# EAGLE design Castle_2_3_1_103113 (EAGLE 9.3.0)
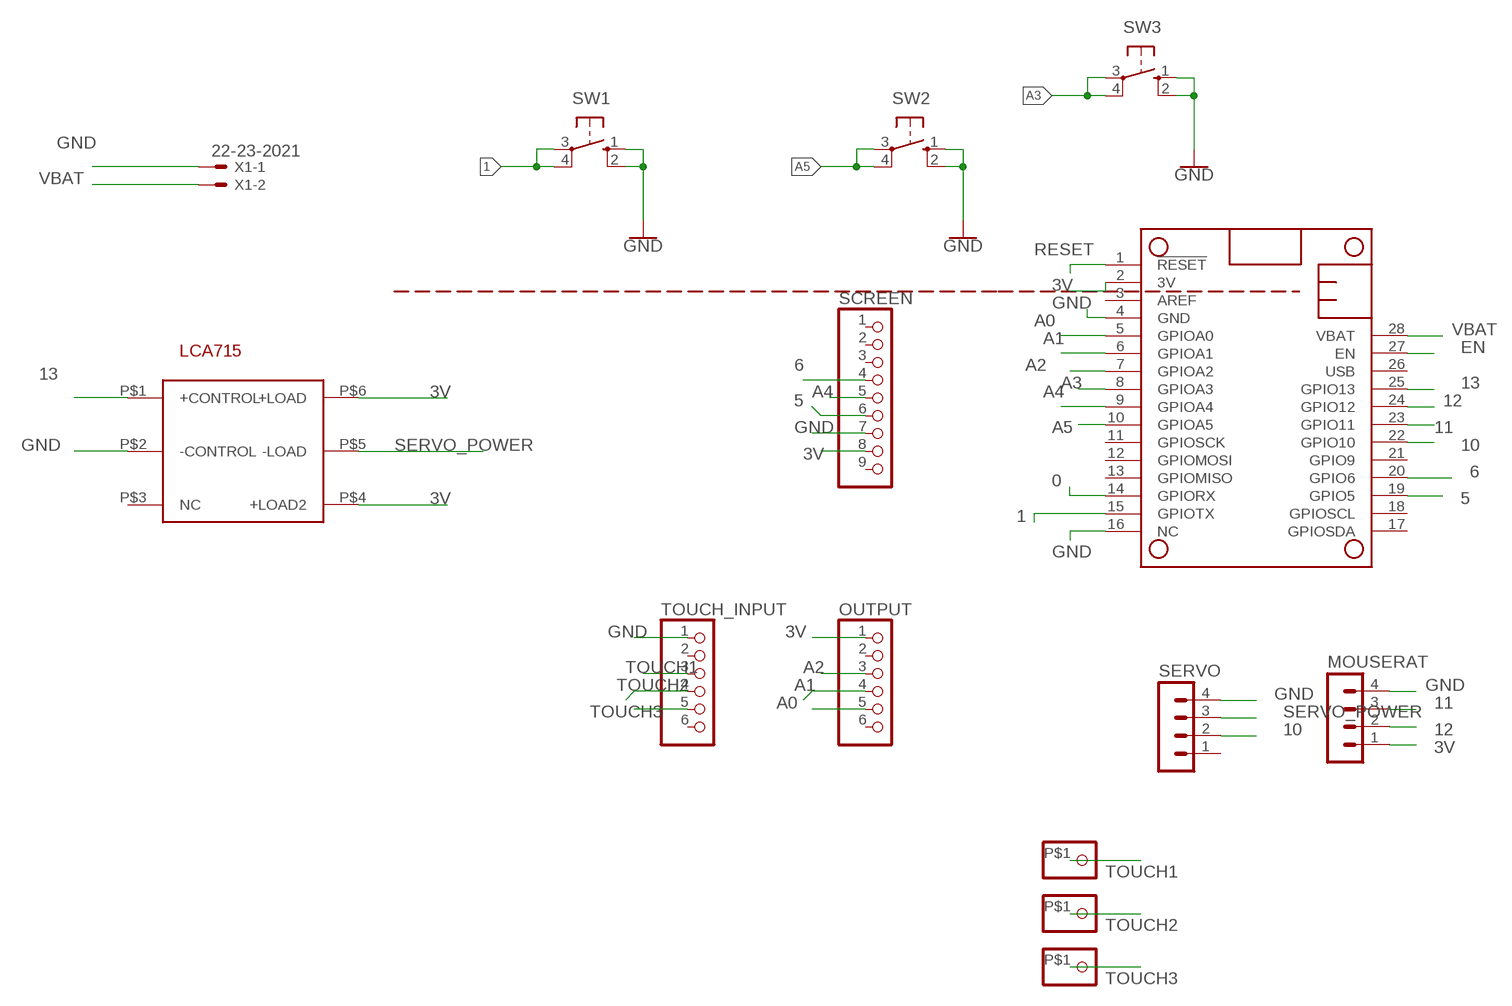
[diagram p0: schematic, sheet 1]

## Parts
EXTRAGND  PINHD-1X1-BIGPOGO  [1X1-BIGPOGO]
EXTRAGND1  PINHD-1X1-BIGPOGO  [1X1-BIGPOGO]
EXTRAGND2  PINHD-1X1-BIGPOGO  [1X1-BIGPOGO]
LCA715  LCA715S  [LCA7XX]
MOUSERAT  MA04-1  [MA04-1]
MS2  FEATHERWING_NODIM  [FEATHERWING_DIM]
OUTPUT  PINHD-1X6  [1X06]
SCREEN  PINHD-1X9  [1X09-BIG]
SERVO  MA04-1  [MA04-1]
SW1  10-XX  [B3F-10XX]
SW2  10-XX  [B3F-10XX]
SW3  10-XX  [B3F-10XX]
TOUCH_INPUT  PINHD-1X6  [1X06]
X1  22-23-2021  [22-23-2021]

## Nets
0: MS2.14(GPIORX)
1: MS2.15(GPIOTX) SW1.3(P) SW1.4(P1)
3V: LCA715.P$4(+LOAD2) LCA715.P$6(+LOAD) MOUSERAT.1 MS2.2(3V) OUTPUT.1 SCREEN.8
5: MS2.19(GPIO5) SCREEN.6
6: MS2.20(GPIO6) SCREEN.4
10: MS2.22(GPIO10) SERVO.2
11: MOUSERAT.3 MS2.23(GPIO11)
12: MOUSERAT.2 MS2.24(GPIO12)
13: LCA715.P$1(+CONTROL) MS2.25(GPIO13)
A0: MS2.5(GPIOA0) OUTPUT.5
A1: MS2.6(GPIOA1) OUTPUT.4
A2: MS2.7(GPIOA2) OUTPUT.3
A3: MS2.8(GPIOA3) SW3.3(P) SW3.4(P1)
A4: MS2.9(GPIOA4) SCREEN.5
A5: MS2.10(GPIOA5) SW2.3(P) SW2.4(P1)
EN: MS2.27(EN)
GND: LCA715.P$2(-CONTROL) MOUSERAT.4 MS2.4(GND) MS2.16(NC) SCREEN.7 SERVO.4 SW1.1(S) SW1.2(S1) SW2.1(S) SW2.2(S1) SW3.1(S) SW3.2(S1) TOUCH_INPUT.1 X1.1
RESET: MS2.1(!RESET)
SERVO_POWER: LCA715.P$5(-LOAD) SERVO.3
TOUCH1: EXTRAGND.P$1 TOUCH_INPUT.3
TOUCH2: EXTRAGND1.P$1 TOUCH_INPUT.4
TOUCH3: EXTRAGND2.P$1 TOUCH_INPUT.5
VBAT: MS2.28(VBAT) X1.2
Unconnected: LCA715.P$3(NC) MS2.3(AREF) MS2.11(GPIOSCK) MS2.12(GPIOMOSI) MS2.13(GPIOMISO) MS2.17(GPIOSDA) MS2.18(GPIOSCL) MS2.21(GPIO9) MS2.26(USB) OUTPUT.2 OUTPUT.6 SCREEN.1 SCREEN.2 SCREEN.3 SCREEN.9 SERVO.1 TOUCH_INPUT.2 TOUCH_INPUT.6

## Library data of the parts
EXTRAGND EXTRAGND1 EXTRAGND2 = adafruit:PINHD-1X1: Pin header 1x1 for 0.1" spacing With round pins
LCA715 = Mohamed's-library:LCA715S
MOUSERAT SERVO = con-lstb:MA04-1: PIN HEADER; OC_FARNELL: unknown; OC_NEWARK: unknown
MS2 = adafruit:FEATHERWING: featherwingflip
OUTPUT TOUCH_INPUT = adafruit:PINHD-1X6: PIN HEADER
SCREEN = adafruit:PINHD-1X9: Pin header 1x10 0.1" spacing With round pins
SW1-SW3 = buttons:10-XX: OMRON SWITCH
X1 = con-molex:22-23-2021: .100" (2.54mm) Center Header - 2 Pin; MF: MOLEX; MPN: 22-23-2021; OC_FARNELL: 1462926; OC_NEWARK: 25C3832

## Board
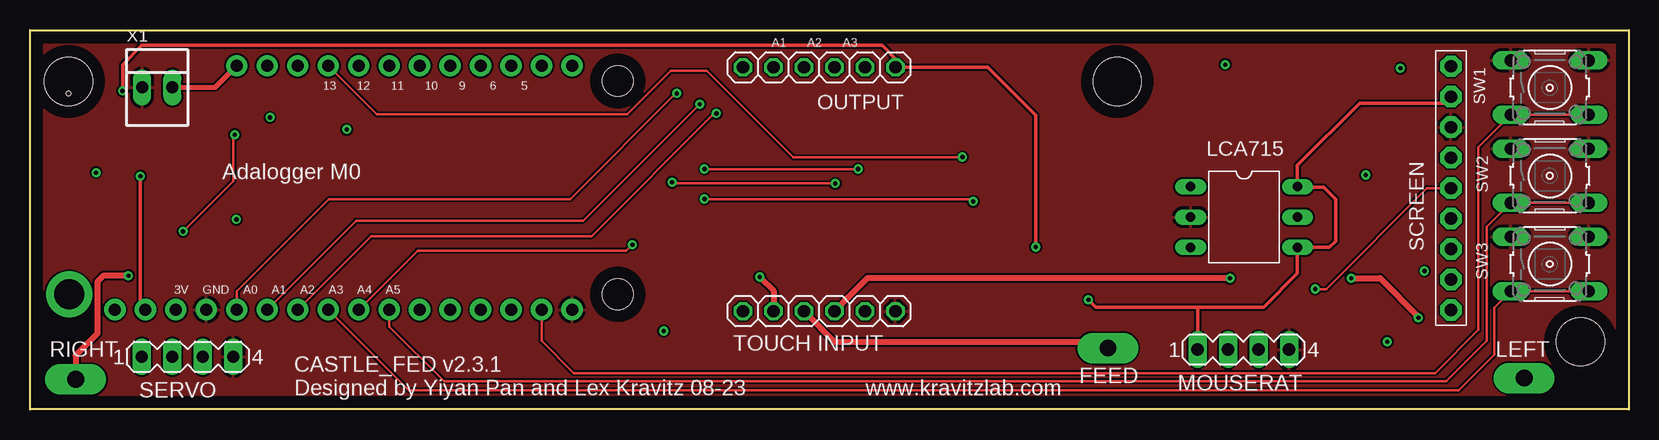
[diagram p1: board, top side]
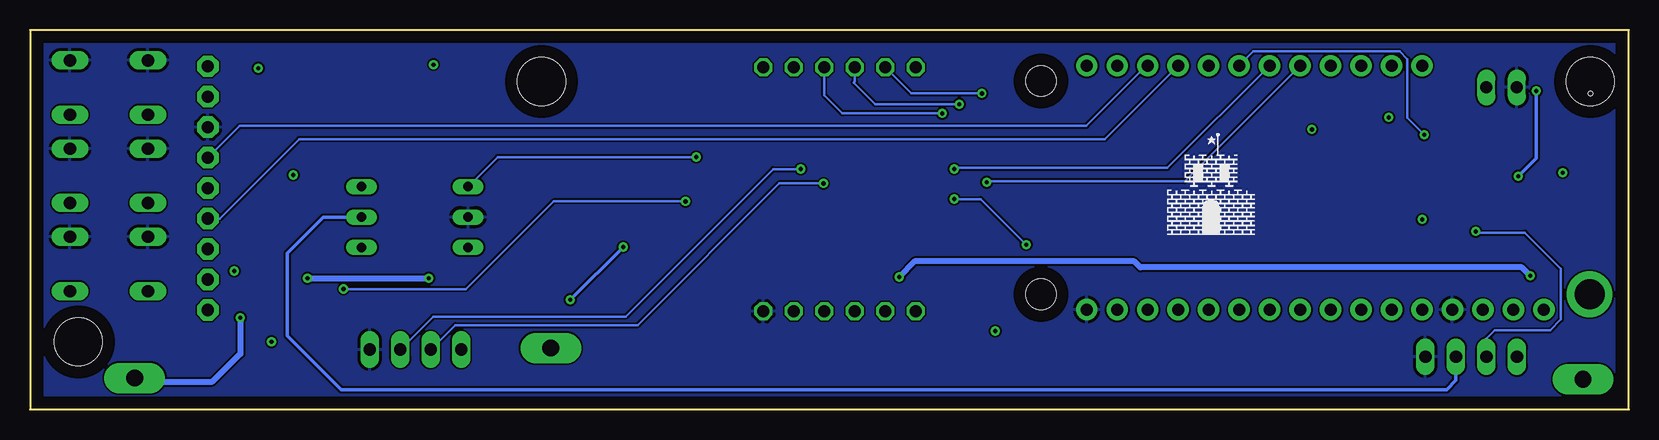
[diagram p2: board, bottom side, seen from below]

Size 133.23 x 31.61 mm. Coordinates in mm from the lower left corner, seen from the top.
Outline: 0,31.61 133.23,31.61 133.23,0 0,0 0,31.61
Copper layers (1*16): Top 0.035mm / dielectric 1.5mm / Bottom 0.035mm
Design rules "default": minimum track width 6mil, minimum drill 0.35mm, track to track 6mil, track to pad 6mil, pad to pad 6mil, via to via 6mil, smd to smd 6mil, copper to edge 40mil, drill to drill 6mil, minimum pad ring 10mil, minimum via ring 8mil, stop-mask expansion 4mil, vias tented up to drill 0mil, thermal gap 10mil
Holes 4 mm at 3.2,27.33 90.6,27.33 129.2,5.63
Holes 0.35 mm at 3.2,26.3

### Footprints (pad centres in the part's own frame; a part is rotated, then mirrored left to right if it is on the bottom)
1X1-BIGPOGO = drill 1.4 pad 2.54 long: P$1 0,0
LCA7XX = drill 0.8 long: P$1 -5.08,2.54; P$2 -5.08,0; P$3 -5.08,-2.54; P$4 3.81,-2.54; P$5 3.81,0; P$6 3.81,2.54
MA04-1 = drill 1.016 long: 1 -3.81,0; 2 -1.27,0; 3 1.27,0; 4 3.81,0
FEATHERWING_DIM = drill 1 pad 1.778: 1 6.35,1.27; 2 8.89,1.27; 3 11.43,1.27; 4 13.97,1.27; 5 16.51,1.27; 6 19.05,1.27; 7 21.59,1.27; 8 24.13,1.27; 9 26.67,1.27; 10 29.21,1.27; 11 31.75,1.27; 12 34.29,1.27; 13 36.83,1.27; 14 39.37,1.27; 15 41.91,1.27; 16 44.45,1.27; 17 44.45,21.59; 18 41.91,21.59; 19 39.37,21.59; 20 36.83,21.59; 21 34.29,21.59; 22 31.75,21.59; 23 29.21,21.59; 24 26.67,21.59; 25 24.13,21.59; 26 21.59,21.59; 27 19.05,21.59; 28 16.51,21.59 | drill 2.5 pad 3.81: P$1 2.54,20.32; P$2 2.54,2.54 | hole 2.54: 48.26,20.32; 48.26,2.54
1X06 = drill 1.016 octagon: 1 -6.35,0; 2 -3.81,0; 3 -1.27,0; 4 1.27,0; 5 3.81,0; 6 6.35,0
1X09-BIG = drill 1.016 pad 1.778 octagon: 1 -10.16,0; 2 -7.62,0; 3 -5.08,0; 4 -2.54,0; 5 0,0; 6 2.54,0; 7 5.08,0; 8 7.62,0; 9 10.16,0
B3F-10XX = drill 1.016 long: 1 -3.251,2.261; 2 3.251,2.261; 3 -3.251,-2.261; 4 3.251,-2.261
22-23-2021 = drill 1 long: 1 -1.27,0; 2 1.27,0

### Placement (x,y rotation side)
EXTRAGND  124.51,2.61 0 top
EXTRAGND1  89.83,5.11 0 top
EXTRAGND2  3.81,2.5 0 top
LCA715  101.8,16.03 0 top
MOUSERAT  101.1,4.98 0 top
MS2  0.72,7.04 0 top
OUTPUT  65.77,28.5 180 top
SCREEN  118.41,18.43 90 top
SERVO  13.13,4.38 0 top
SW1  126.65,26.81 0 top
SW2  126.65,19.46 0 top
SW3  126.65,12.11 0 top
TOUCH_INPUT  65.77,8.18 180 top
X1  10.6,26.83 0 top

### Tracks (layer width: path | path; a pad name or v marks a point on that pad's centre or on a via)
1
  Top 0.203: SW1.4 SW1.3 120.7,21.86 120.7,6.63 117.1,3.03 45.3,3.03 42.63,5.7 MS2.15
3V  (via drill 0.35)
  Top 0.305: SCREEN.8 117.88,25.53 110.8,25.53 105.61,20.34 LCA715.P$6 105.65,18.53 107.8,18.53 108.8,17.53 108.8,14.03 108.26,13.49 LCA715.P$4 105.61,11.34 102.8,8.53 97.29,8.53 | 97.29,8.53 MOUSERAT.1 | v7.71,26.53 7.71,28.73 9.3,30.33 71,30.33 72.3,29.03 72.3,28.03 72.12,28.21 OUTPUT.1 79.78,28.5 79.8,28.53 83.8,24.53 v83.8,13.53 | 97.29,8.53 88.8,8.53 v88.2,9.13 | v9.2,19.43 9.2,8.72 MS2.2
  Bottom 0.305: v9.2,19.43 9.2,19.44 7.71,20.93 v7.71,26.53 | v88.2,9.13 v83.8,13.53
5
  Bottom 0.203: SCREEN.6 115.76,23.63 45.2,23.63 40.19,28.64 MS2.19
6
  Bottom 0.203: MS2.20 43.66,22.53 110.8,22.53 117.43,15.89 SCREEN.4
10  (via drill 0.35)
  Top 0.203: v12.75,14.83 16.95,19.03 16.95,22.78 v17.05,22.88
  Bottom 0.203: MS2.22 31.28,29.83 19.1,29.83 18.45,29.18 18.45,24.28 v17.05,22.88 | v12.75,14.83 12.75,14.73 8.65,14.73 5.65,11.73 5.65,7.49 6.56,6.58 11.16,6.58 11.86,5.88 SERVO.2
11  (via drill 0.35)
  Top 0.203: v69,20.03 v56.2,20.03
  Bottom 0.203: MS2.23 38.44,20.13 56.2,20.13 v56.2,20.03 | MOUSERAT.3 99.63,7.73 83.6,7.73 71.3,20.03 v69,20.03
12  (via drill 0.35)
  Top 0.203: v53.5,18.93 53.6,18.83 v67.1,18.83
  Bottom 0.203: MOUSERAT.2 97.79,7.03 82.6,7.03 70.8,18.83 v67.1,18.83 | MS2.24 37,19.03 53.4,19.03 v53.5,18.93
13  (via drill 0.35)
  Top 0.203: MS2.25 28.88,24.6 49.76,24.6 53.38,28.23 56.4,28.23 63.6,21.03 v77.7,21.03
  Bottom 0.203: v77.7,21.03 94.26,21.03 LCA715.P$1
A0  (via drill 0.35)
  Top 0.203: v53.9,26.33 53.8,26.33 45,17.53 24.9,17.53 17.23,9.85 MS2.5
  Bottom 0.203: OUTPUT.5 59.78,26.33 v53.9,26.33
A1  (via drill 0.35)
  Top 0.203: MS2.6 27.18,15.73 46.1,15.73 v55.8,25.43
  Bottom 0.203: v55.8,25.43 62.8,25.43 64.6,27.23 64.5,27.33 OUTPUT.4
A2  (via drill 0.35)
  Top 0.203: MS2.7 28.42,14.43 46.8,14.43 57.03,24.66 v57.2,24.66
  Bottom 0.203: v57.2,24.66 65.53,24.66 67.04,26.16 OUTPUT.3
A3
  Top 0.203: SW3.4 SW3.3 122,8.45 122,4.55 119.05,1.59 31.57,1.59 MS2.8
A4  (via drill 0.35)
  Top 0.203: MS2.9 32.3,13.23 49.7,13.23 v50.2,13.73 | v56.2,17.53 78.4,17.53 v78.6,17.33 | v107.1,10.03 108,10.03 116.41,18.43 SCREEN.5
  Bottom 0.203: v78.6,17.33 89.6,17.33 96.9,10.03 v107.1,10.03 | v56.2,17.53 54,17.53 v50.2,13.73
A5
  Top 0.203: SW2.4 SW2.3 121.4,15.2 121.4,5.73 118,2.33 34.5,2.33 29.93,6.9 MS2.10
GND
  pour Top: -4.14,42.06 144.98,42.06 144.98,-12.54 -4.14,-12.54
  pour Bottom: -6.41,42.06 153.12,42.06 153.12,-20.16 -6.41,-20.16
N$1  (via drill 0.35)
  other vias: 20,24.33
N$2  (via drill 0.35)
  other vias: 5.5,19.73
N$3  (via drill 0.35)
  other vias: 17.2,15.83
N$4  (via drill 0.35)
  other vias: 99.6,28.73
N$5  (via drill 0.35)
  other vias: 111.3,19.53
N$6  (via drill 0.35)
  other vias: 116.2,11.53
N$7  (via drill 0.35)
  other vias: 114.2,28.43
N$9  (via drill 0.35)
  other vias: 52.8,6.53
N$10  (via drill 0.35)
  other vias: 26.4,23.33
N$11  (via drill 0.35)
  other vias: 113.1,5.63
SERVO_POWER
  Bottom 0.305: LCA715.P$5 108.8,16.03 111.8,13.03 111.8,6.14 107.3,1.64 15.18,1.64 14.4,2.43 SERVO.3
TOUCH1  (via drill 0.35)
  Top 0.508: TOUCH_INPUT.3 69.78,10.93 v100,10.93 | v110.1,10.93 112.5,10.93 115.7,7.73 v115.7,7.63
  Bottom 0.152: 124.21,2.3 EXTRAGND.P$1
  Bottom 0.508: v110.1,10.93 v100,10.93 | v115.7,7.63 115.7,4.63 118.02,2.3 124.21,2.3
TOUCH2
  Top 0.508: EXTRAGND1.P$1 89.33,5.61 67.07,5.61 TOUCH_INPUT.4
TOUCH3  (via drill 0.35)
  Top 0.508: v8.2,11.13 6.1,11.13 5.61,10.63 5.61,6.3 3.81,4.5 EXTRAGND2.P$1 | v60.8,11.03 61.96,9.87 TOUCH_INPUT.5
  Bottom 0.508: v8.2,11.13 8.9,11.83 40.7,11.83 41.2,12.33 59.5,12.33 v60.8,11.03
VBAT
  Top 0.406: X1.2 15.42,26.83 MS2.28

### Text on the board
tNames: A1 A2 A3 | 13 12 11 10 9 6 5 | Adalogger M0 | 3V GND A0 A1 A2 A3 A4 A5 | TOUCH INPUT | RIGHT | LEFT | FEED | MOUSERAT | SERVO | CASTLE_FED v2.3.1 / Designed by Yiyan Pan and Lex Kravitz 08-23 www.kravitzlab.com